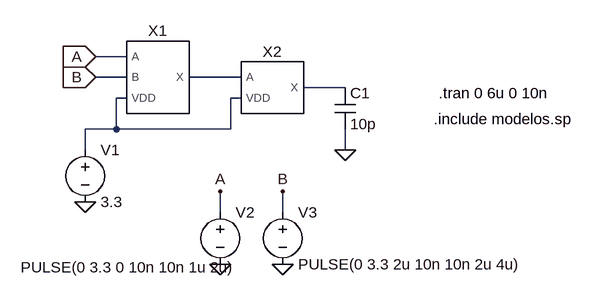
[diagram p0: schematic AND_2IN_1MA.asc]
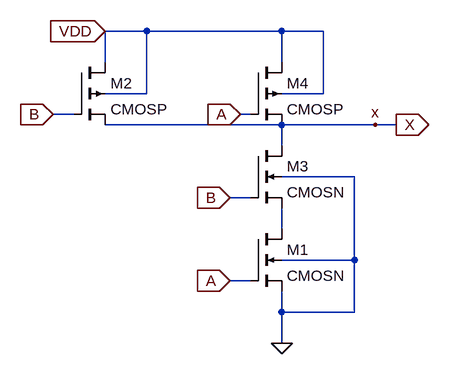
[diagram p1: sub-circuit nand1ma_2in_simb.asc]
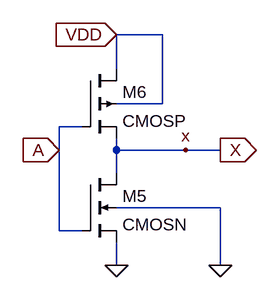
[diagram p2: sub-circuit inversor1ma.asc]
AND_2IN_1MA.asc, the LTspice schematic file:
Version 4
SHEET 1 880 680
WIRE 48 96 0 96
WIRE 48 128 0 128
WIRE 224 128 144 128
WIRE 384 144 320 144
WIRE 48 160 32 160
WIRE 224 160 208 160
WIRE 32 208 32 160
WIRE 32 208 -16 208
WIRE 208 208 208 160
WIRE 208 208 32 208
WIRE -16 240 -16 208
WIRE 384 240 384 208
WIRE 192 336 192 304
WIRE 288 336 288 304
FLAG 384 240 0
FLAG -16 320 0
FLAG 0 96 A
IOPIN 0 96 In
FLAG 0 128 B
IOPIN 0 128 In
FLAG 192 304 A
FLAG 288 304 B
FLAG 192 416 0
FLAG 288 416 0
SYMBOL NAND1mA_2IN_SIMB 96 128 R0
SYMATTR InstName X1
SYMBOL Inversor1mA 272 144 R0
SYMATTR InstName X2
SYMBOL cap 368 144 R0
SYMATTR InstName C1
SYMATTR Value 10p
SYMBOL voltage -16 224 R0
WINDOW 123 0 0 Left 0
WINDOW 39 0 0 Left 0
SYMATTR InstName V1
SYMATTR Value 3.3
SYMBOL voltage 192 320 R0
WINDOW 3 -307 101 Left 2
WINDOW 123 0 0 Left 0
WINDOW 39 0 0 Left 0
SYMATTR InstName V2
SYMATTR Value PULSE(0 3.3 0 10n 10n 1u 2u)
SYMBOL voltage 288 320 R0
WINDOW 123 0 0 Left 0
WINDOW 39 0 0 Left 0
SYMATTR InstName V3
SYMATTR Value PULSE(0 3.3 2u 10n 10n 2u 4u)
TEXT 520 192 Left 2 !.include modelos.sp
TEXT 528 152 Left 2 !.tran 0 6u 0 10n

nand1ma_2in_simb.asc, the sub-circuit schematic file:
Version 4
SHEET 1 1484 824
WIRE 224 -240 160 -240
WIRE 432 -240 224 -240
WIRE 496 -240 432 -240
WIRE 160 -192 160 -240
WIRE 432 -192 432 -240
WIRE 224 -144 224 -240
WIRE 224 -144 160 -144
WIRE 496 -144 496 -240
WIRE 496 -144 432 -144
WIRE 112 -112 80 -112
WIRE 384 -112 368 -112
WIRE 432 -96 160 -96
WIRE 576 -96 432 -96
WIRE 608 -96 576 -96
WIRE 432 -64 432 -96
WIRE 544 -16 432 -16
WIRE 384 16 352 16
WIRE 432 64 432 32
WIRE 544 112 544 -16
WIRE 544 112 432 112
WIRE 384 144 352 144
WIRE 432 192 432 160
WIRE 544 192 544 112
WIRE 544 192 432 192
WIRE 432 240 432 192
FLAG 432 240 0
FLAG 80 -112 B
IOPIN 80 -112 In
FLAG 576 -96 x
FLAG 368 -112 A
IOPIN 368 -112 In
FLAG 352 16 B
IOPIN 352 16 In
FLAG 352 144 A
IOPIN 352 144 In
FLAG 608 -96 X
IOPIN 608 -96 Out
FLAG 160 -240 VDD
IOPIN 160 -240 In
SYMBOL nmos4 384 64 R0
SYMATTR InstName M1
SYMATTR Value CMOSN
SYMATTR Value2 l=0.6u w=4.2u
SYMBOL pmos4 112 -192 R0
SYMATTR InstName M2
SYMATTR Value CMOSP
SYMATTR Value2 l=.6u w=11.6u
SYMBOL nmos4 384 -64 R0
SYMATTR InstName M3
SYMATTR Value CMOSN
SYMATTR Value2 l=0.6u w=4.2u
SYMBOL pmos4 384 -192 R0
SYMATTR InstName M4
SYMATTR Value CMOSP
SYMATTR Value2 l=.6u w=11.6u

inversor1ma.asc, the sub-circuit schematic file:
Version 4
SHEET 1 1388 680
WIRE 368 16 304 16
WIRE 304 64 304 16
WIRE 368 112 368 16
WIRE 368 112 304 112
WIRE 256 144 224 144
WIRE 224 176 224 144
WIRE 304 176 304 160
WIRE 400 176 304 176
WIRE 448 176 400 176
WIRE 304 208 304 176
WIRE 448 256 304 256
WIRE 224 288 224 176
WIRE 256 288 224 288
WIRE 304 336 304 304
WIRE 448 336 448 256
FLAG 304 336 0
FLAG 448 336 0
FLAG 224 176 A
IOPIN 224 176 In
FLAG 400 176 x
FLAG 448 176 X
IOPIN 448 176 Out
FLAG 304 16 VDD
IOPIN 304 16 In
SYMBOL nmos4 256 208 R0
SYMATTR InstName M5
SYMATTR Value CMOSN
SYMATTR Value2 l=0.6u w=4.2u
SYMBOL pmos4 256 64 R0
SYMATTR InstName M6
SYMATTR Value CMOSP
SYMATTR Value2 l=.6u w=14u

The netlist it stands for:
* AND_2IN_1MA.asc
XX1 A B N003 N001 nand1ma_2in_simb
XX2 N001 N003 N002 inversor1ma
C1 N002 0 10p
V1 N003 0 3.3
V2 A 0 PULSE(0 3.3 0 10n 10n 1u 2u)
V3 B 0 PULSE(0 3.3 2u 10n 10n 2u 4u)

* block symbol definitions
.subckt nand1ma_2in_simb A B VDD X
M1 N001 A 0 0 CMOSN l=0.6u w=4.2u
M2 VDD B x VDD CMOSP l=.6u w=11.6u
M3 x B N001 0 CMOSN l=0.6u w=4.2u
M4 VDD A x VDD CMOSP l=.6u w=11.6u
.ends nand1ma_2in_simb

.subckt inversor1ma A VDD X
M5 x A 0 0 CMOSN l=0.6u w=4.2u
M6 VDD A x VDD CMOSP l=.6u w=14u
.ends inversor1ma

.model NMOS NMOS
.model PMOS PMOS
.lib standard.mos
.include modelos.sp
.tran 0 6u 0 10n
.backanno
.end

* Results of the author's LTspice run, read from the files saved beside the schematic
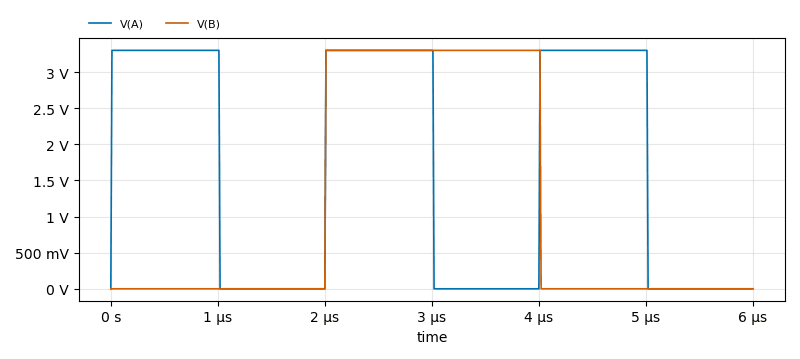
[diagram p3: Transient Analysis of AND_2IN_1MA.asc, plotted from the saved traces]
* Transient Analysis, 1 run:
*   V(A): min 0 V, max 3.3 V, average 1.666 V, rms 2.341 V, last 0 V
*   V(B): min 0 V, max 3.3 V, average 1.105 V, rms 1.908 V, last 0 V